# EasyEDA Pro project PixelClock像素时钟-开源Pix24-O.eprj, board PCB3_16
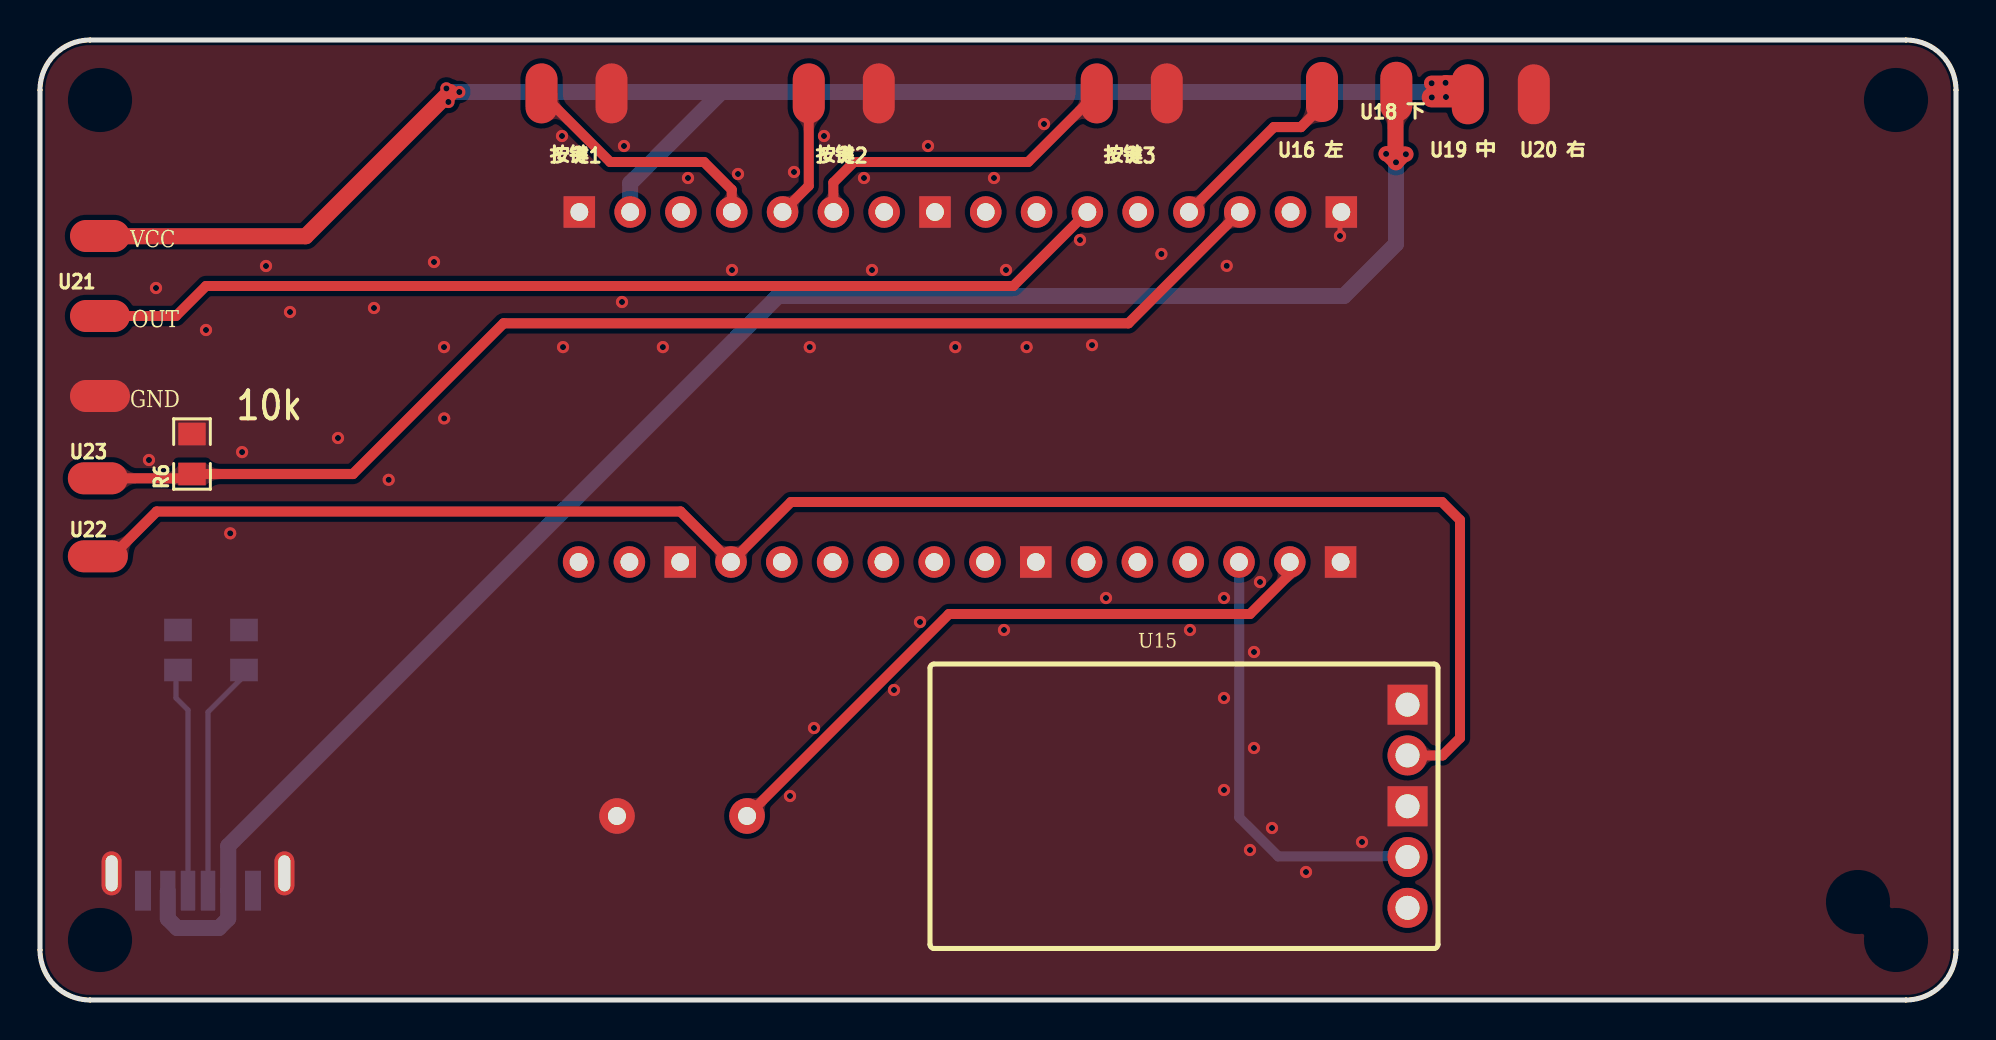
[diagram p4: board, top side]
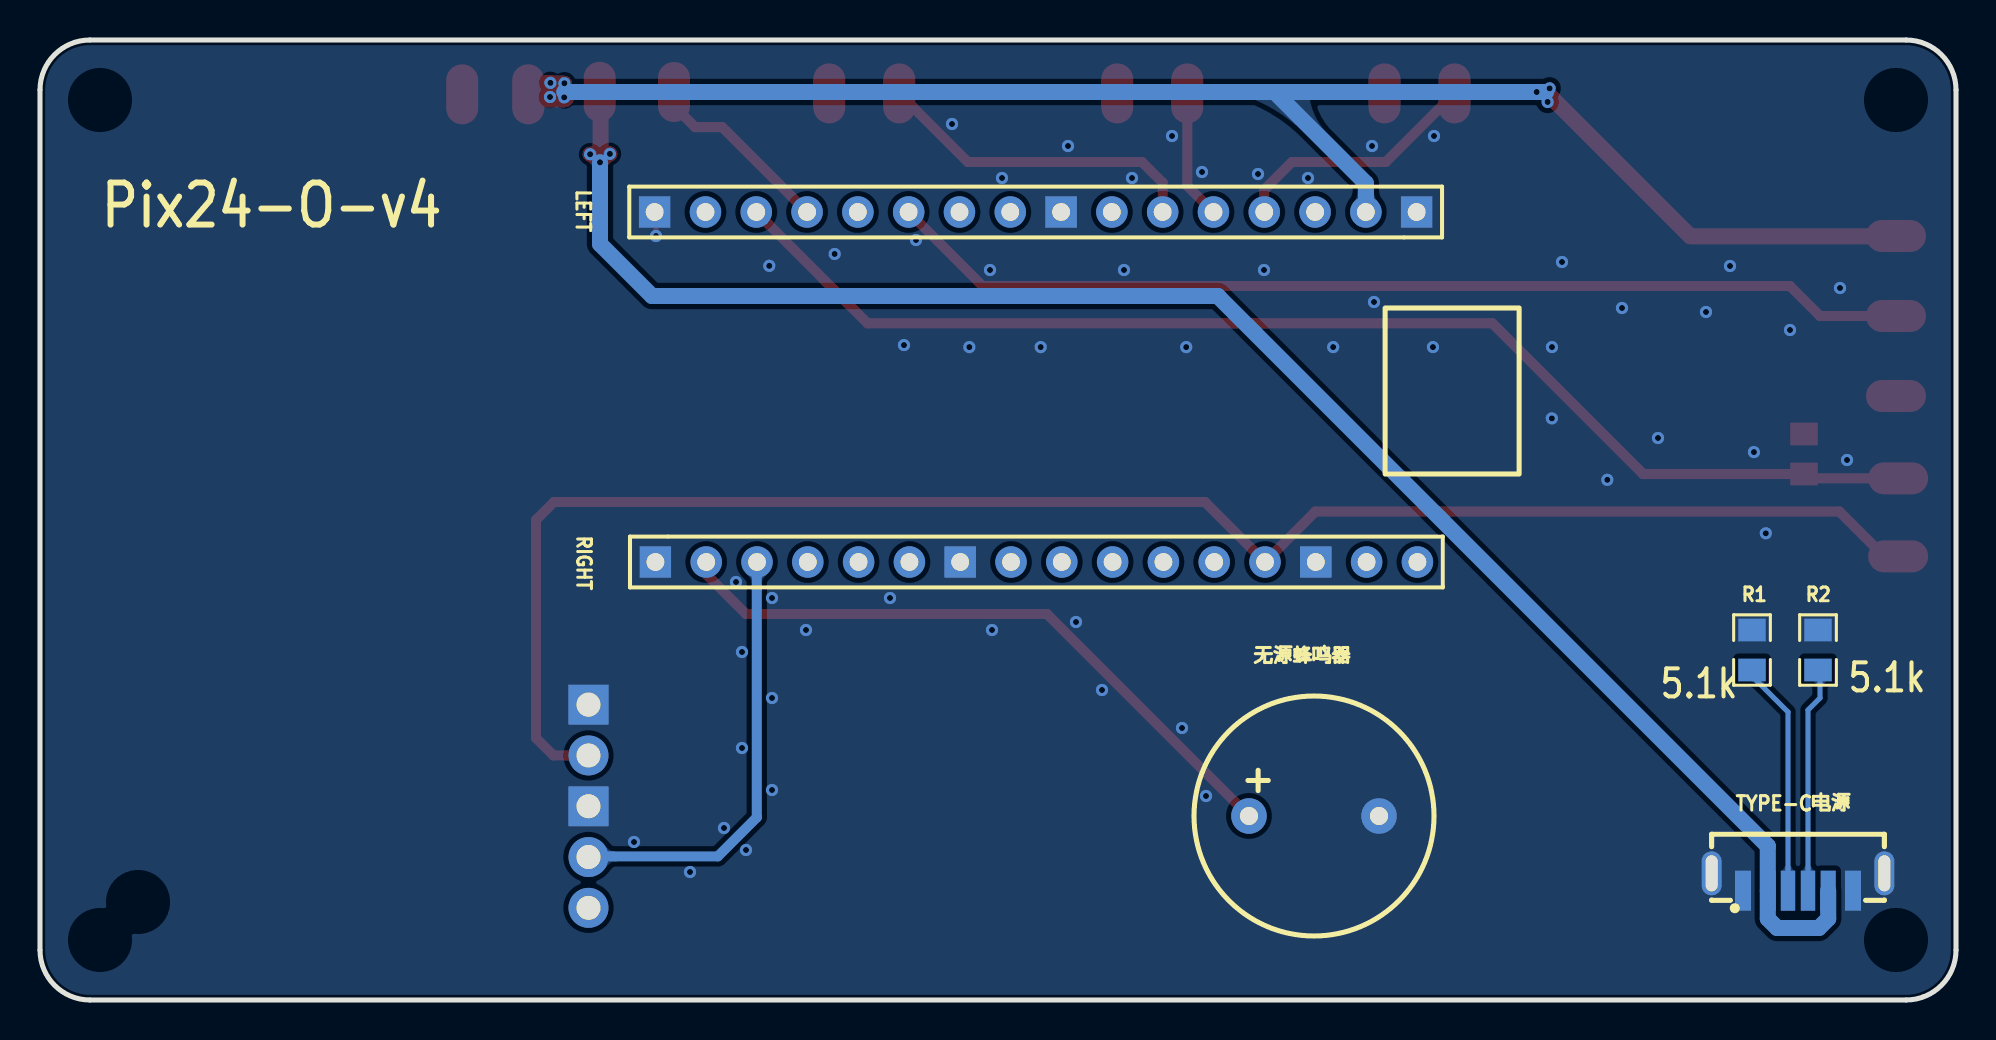
[diagram p5: board, bottom side, seen from below]

Outline 95.8 x 48 mm; copper layers: Top Layer, Bottom Layer. Coordinates in mm from the lower left corner of the outline.
Outline path: 0,45.5 0,2.5 arc(0.73,0.73) 2.5,0 93.3,0 arc(95.07,0.73) 95.8,2.5 95.8,45.5 arc(95.07,47.27) 93.3,48 2.5,48 arc(0.73,47.27) 0,45.5
Stack: Top Layer 0.035mm - / Dielectric1 1.51mm FR4 er 4.5 / Bottom Layer 0.035mm -

## Design rules (mm)
template: 自定义配置
spacing copperThickness1oz (default): track to track 0.102, other pairs 0.152 to 0.3
spacing copperThickness2oz: track to track 0.203, other pairs 0.152 to 0.3
track width copperThickness1oz (default): min 0.127, default 0.254, max 2.54
track width copperThickness2oz: min 0.203, default 0.254, max 2.54
differential pair differentialPair (default): width min 0.127, default 0.254, max 2.54; gap min 0.152, default 0.152
via viaSize (default): diameter min 0.5, default 0.61, max 10; hole min 0.3, default 0.305, max 6.3

## Placement (name value [footprint] x y rotation side)
LEFT  HDR-F-2.54_1x16  [hdr-f-2.54_1x16]  46.02 39.4 0 bottom
R1  5.1k  [R0805]  10.2 17.5 90 bottom
R2  5.1k  [R0805]  6.9 17.5 90 bottom
R6  10kΩ  [R0805]  7.6 27.3 90 top
RIGHT  HDR-F-2.54_1x16  [HDR-F-2.54_1X16]  45.98 21.9 180 bottom
TYPE-C电源  TYPE-C 6P LT6.8(073)  [USB-C-SMD_TYPE-C-6P-LT6.8-073]  7.9 5.9 180 bottom
U6  -  [长圆形单面焊盘]  24.95 45.33 90 top
U8  -  [长圆形单面焊盘]  38.31 45.33 90 top
U10  -  [长圆形单面焊盘]  52.71 45.33 90 top
U15  -  [max9814模块]  44.5 16.8 0 top
U16 左  -  [长圆形单面焊盘]  63.97 45.4 90 top
U17  -  [长圆形单面焊盘]  3 30.33 0 top
U18 下  -  [长圆形单面焊盘]  67.69 45.41 90 top
U19 中  -  [长圆形单面焊盘]  71.26 45.28 90 top
U20 右  -  [长圆形单面焊盘]  74.56 45.28 90 top
U21  -  [长圆形单面焊盘]  3 34.33 0 top
U22  -  [长圆形单面焊盘]  2.89 22.31 0 top
U23  -  [长圆形单面焊盘]  2.89 26.21 0 top
按键1  -  [长圆形单面焊盘]  28.45 45.33 90 top
按键2  -  [长圆形单面焊盘]  41.81 45.33 90 top
按键3  -  [长圆形单面焊盘]  56.21 45.33 90 top
无源蜂鸣器  无源蜂鸣器  [BUZ-TH_BD12.0-P6.50-D0.6-FD]  32.1 9.2 180 bottom
电源开关1  -  [长圆形单面焊盘]  3 38.33 0 top

## Footprints (pads in the part's own frame, mm; a bottom-side part is the same pattern mirrored in y, then rotated)
BUZ-TH_BD12.0-P6.50-D0.6-FD
  round 1.778 hole 0.899: 1(-3.251,0) 2(3.251,0)
hdr-f-2.54_1x16
  rect 1.575x1.575 hole 0.889: 1(-19.05,0) 8(-1.27,0) 16(19.05,0)
  round 1.575 hole 0.889: 2(-16.51,0) 3(-13.97,0) 4(-11.43,0) 5(-8.89,0) 6(-6.35,0) 7(-3.81,0) 9(1.27,0) 10(3.81,0) 11(6.35,0) 12(8.89,0) 13(11.43,0) 14(13.97,0) 15(16.51,0)
HDR-F-2.54_1X16
  rect 1.575x1.575 hole 0.889: 1(-19.05,0) 7(-3.81,0) 14(13.97,0)
  round 1.575 hole 0.889: 2(-16.51,0) 3(-13.97,0) 4(-11.43,0) 5(-8.89,0) 6(-6.35,0) 8(-1.27,0) 9(1.27,0) 10(3.81,0) 11(6.35,0) 12(8.89,0) 13(11.43,0) 15(16.51,0) 16(19.05,0)
max9814模块
  round 2 hole 1.2: 1(23.876,-12.192) 2(23.876,-9.652) 4(23.876,-4.572)
  rect 2x2 hole 1.2: 3(23.876,-7.112) 5(23.876,-2.032)
R0805
  rect 1.133x1.377 smd: 1(-1,0) 2(1,0)
USB-C-SMD_TYPE-C-6P-LT6.8-073
  oval 1x2.2 hole 0.6x1.8: 7(-4.32,0.432) 8(4.32,0.432)
  rect 0.72x2 smd: A5(-0.5,-0.432) B5(0.5,-0.432)
  rect 0.76x2 smd: A9(1.51,-0.432) B9(-1.51,-0.432)
  custom 0.8x2 smd: A12(2.75,-0.432)
  rect 0.8x2 smd: B12(-2.75,-0.432)
长圆形单面焊盘
  oval 3x1.6 smd: 1(0,-0.127)

## Nets
3V3: RIGHT.13 U15.4 U22.1
GND: LEFT.1 LEFT.8 LEFT.16 R1.2 R2.2 R6.2 RIGHT.1 RIGHT.7 RIGHT.14 TYPE-C电源.7 TYPE-C电源.8 TYPE-C电源.A12 TYPE-C电源.B12 U15.3 U15.5 U17.1 U20 右.1 按键1.1 按键2.1 按键3.1 无源蜂鸣器.2
VCC: LEFT.2 U19 中.1 电源开关1.1
BTN1: LEFT.4 U6.1
BTN2: LEFT.5 U8.1
BTN3: LEFT.6 U10.1
BUZZER: RIGHT.2 无源蜂鸣器.1
GPIO_2: LEFT.14 R6.1 U23.1
GPIO_3: LEFT.13 U16 左.1
GPIO_6: LEFT.11 U21.1
GPIO_10: LEFT.12
SW: TYPE-C电源.A9 TYPE-C电源.B9 U18 下.1
VOICE: RIGHT.3 U15.2
$1N4002: R1.1 TYPE-C电源.A5
$1N4005: R2.1 TYPE-C电源.B5

Pads without a net: LEFT 3 7 9 10 15; RIGHT 4 5 6 8 9 10 11 12 15 16; U15 1

## Via types
v1: diameter 0.61, hole 0.305, Top Layer to Bottom Layer, 64 vias

## Routing (per net, layer and track width the routed paths; a pad name or vN(x,y) marks a point on that pad's centre or on a via; arc(x,y) is an arc through that point)
3V3: length 85.6
  Top Layer w0.5: U15.4 70.13,12.23 71,13.1 71,24 70.1,24.9 37.55,24.9 RIGHT.13
  Top Layer w0.508: RIGHT.13 32.03,24.42 5.83,24.42 3.59,22.18 U22.1
GND: length 1.2
  Top Layer w0.254: 64.99,39.4 65,39.39 v1(65,38.2)
  vias: v1(5.45,27) v1(5.8,35.6) v1(8.3,33.5) v1(9.51,23.33) v1(10.1,27.4) v1(11.3,36.7) v1(12.5,34.4) v1(14.9,28.1) v1(16.7,34.6) v1(17.43,26.01) v1(19.7,36.9) v1(20.2,32.65) v1(20.21,29.08) v1(26.1,43.2) v1(26.15,32.65) v1(29.1,34.9) v1(29.2,42.7) v1(31.14,32.65) v1(32.4,41.1) v1(34.6,36.5) v1(34.9,41.3) v1(37.5,10.2) v1(37.7,41.4) v1(38.49,32.65) v1(38.7,13.6) v1(39.2,43.2) v1(41.2,41.1) v1(41.6,36.5) v1(42.7,15.5) v1(44,18.9) v1(44.4,42.7) v1(45.77,32.65) v1(47.7,41.1) v1(48.2,18.5) v1(48.3,36.5) v1(49.33,32.65) v1(50.2,43.8) v1(52,38) v1(52.6,32.75) v1(53.3,20.1) v1(56.07,37.3) v1(57.5,18.5) v1(59.2,20.1) v1(59.2,15.1) v1(59.2,10.5) v1(59.34,36.71) v1(60.5,7.5) v1(60.7,17.4) v1(60.7,12.6) v1(61,20.9) v1(61.6,8.6) v1(63.3,6.4) v1(66.1,7.9)
VCC: length 81.9
  Top Layer w0.254: v1(20.97,45.4) 20.47,44.9 v1(20.42,44.9) ; 29.45,39.38 29.43,39.4
  Top Layer w0.762: v1(69.58,45.84) 70.26,45.84 v1(70.28,45.86) 70.82,45.86 U19 中.1
  Top Layer w0.8: 2.99,38.2 3,38.19 13.29,38.19 20.5,45.4
  Top Layer w1: v1(69.59,45.13) 71.17,45.13
  Bottom Layer w0.8: 34.07,45.4 v1(20.97,45.4) 20.5,45.4 ; 34.07,45.4 29.51,40.84 LEFT.2 ; 34.07,45.4 69.59,45.4
  vias: v1(20.32,45.58) v1(70.3,45.15)
BTN1: length 12.6
  Top Layer w0.5: LEFT.4 34.59,40.51 33.2,41.9 28.51,41.9 U6.1
BTN2: length 6.5
  Top Layer w0.5: U8.1 38.44,40.71 LEFT.5
BTN3: length 16.5
  Top Layer w0.5: 52.84,45.33 49.41,41.9 40.7,41.9 39.67,40.87 LEFT.6
BUZZER: length 32.8
  Top Layer w0.5: RIGHT.2 62.49,21.29 60.5,19.3 45.45,19.3 无源蜂鸣器.1
GPIO_2: length 62.6
  Top Layer w0.508: U23.1 7.38,26.08 R6.1 15.65,26.3 23.18,33.83 54.42,33.83 LEFT.14
GPIO_3: length 9.5
  Top Layer w0.508: U16 左.1 64.1,44.7 63.05,43.65 61.69,43.65 LEFT.13
GPIO_6: length 51.6
  Top Layer w0.5: LEFT.11 48.67,35.7 8.3,35.7 6.8,34.2 3.28,34.2 2.99,34.49
SW: length 88.1
  Top Layer w0.762: v1(68.3,42.29) 68.2,42.29 v1(67.8,41.88) ; v1(67.3,42.31) 67.38,42.31 67.77,41.91
  Top Layer w0.8: 67.77,45.33 67.77,41.91 v1(67.8,41.88)
  Bottom Layer w0.8: TYPE-C电源.A9 6.39,4.07 6.86,3.6 8.94,3.6 9.41,4.07 TYPE-C电源.B9 9.41,7.7 36.91,35.2 65.2,35.2 67.8,37.8 v1(67.8,41.88)
VOICE: length 22
  Bottom Layer w0.5: RIGHT.3 59.96,21.89 59.96,9.13 61.91,7.18 68.34,7.18 U15.2
$1N4002: length 11.8
  Bottom Layer w0.254: R1.1 10.2,16.2 8.4,14.4 TYPE-C电源.A5
$1N4005: length 11.3
  Bottom Layer w0.254: R2.1 6.8,16.4 6.8,15.1 7.4,14.5 TYPE-C电源.B5

## Copper pours and planes (outline as drawn; the poured copper is in the pictures)
GND on Top Layer: -1.43,53.88 96.68,53.88 96.68,-1.03 -1.43,-1.03
GND on Bottom Layer: -1.58,48.79 96.68,48.79 96.68,-8.85 -1.58,-8.85

Small or netless copper shapes (teardrops, artwork), in the pictures only: 24 on Top Layer, 9 on Bottom Layer

## Text on the board
Bottom Silkscreen Layer: 5.1k | Pix24-O-v4
Top Silkscreen Layer: 10k | VCC | GND | OUT
